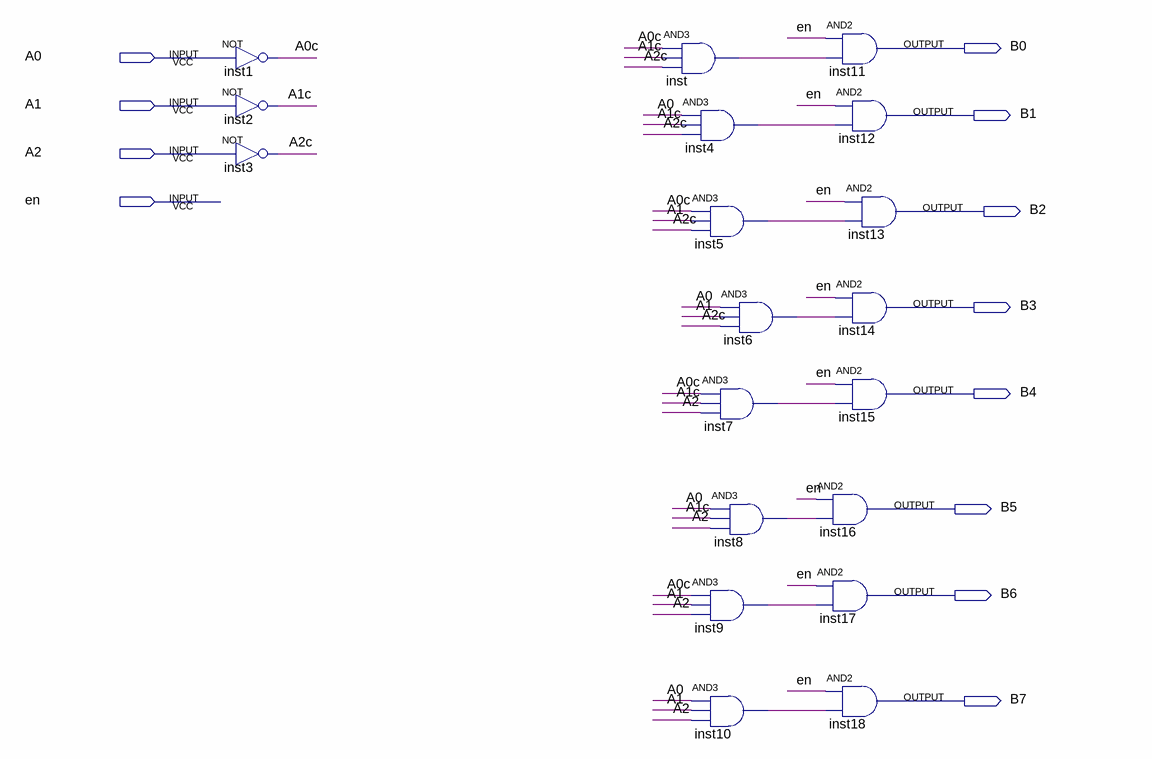
[diagram p0: schematic sheet]
// Quartus schematic DC8.bdf as structural Verilog: 19 symbols, 12 pins
module DC8 (
  input  A0,
  input  A1,
  input  A2,
  input  en,
  output B0,
  output B1,
  output B2,
  output B3,
  output B4,
  output B5,
  output B6,
  output B7
);

  wire A0c, A1c, A2c, inst4_out, inst5_out, inst6_out, inst7_out, inst8_out, inst9_out, inst10_out, inst_out;

  not inst1 (A0c, A0);
  not inst2 (A1c, A1);
  not inst3 (A2c, A2);
  and inst (inst_out, A0c, A1c, A2c);
  and inst4 (inst4_out, A0, A1c, A2c);
  and inst5 (inst5_out, A0c, A1, A2c);
  and inst6 (inst6_out, A0, A1, A2c);
  and inst7 (inst7_out, A0c, A1c, A2);
  and inst8 (inst8_out, A0, A1c, A2);
  and inst9 (inst9_out, A0c, A1, A2);
  and inst10 (inst10_out, A0, A1, A2);
  and inst11 (B0, en, inst_out);
  and inst12 (B1, en, inst4_out);
  and inst13 (B2, en, inst5_out);
  and inst14 (B3, en, inst6_out);
  and inst15 (B4, en, inst7_out);
  and inst16 (B5, en, inst8_out);
  and inst17 (B6, en, inst9_out);
  and inst18 (B7, en, inst10_out);
endmodule
